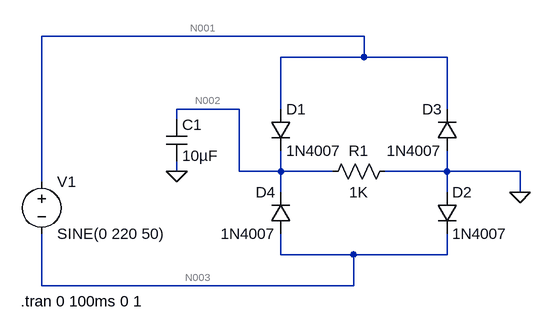
[diagram p0: schematic FullWave.asc]
FullWave.asc, the LTspice schematic file:
Version 4.1
SHEET 1 880 680
WIRE 384 -176 -112 -176
WIRE 384 -144 384 -176
WIRE 384 -144 256 -144
WIRE 512 -144 384 -144
WIRE 192 -64 96 -64
WIRE 256 -64 256 -144
WIRE 512 -64 512 -144
WIRE 96 -48 96 -64
WIRE 96 32 96 16
WIRE 192 32 192 -64
WIRE 256 32 256 0
WIRE 256 32 192 32
WIRE 336 32 256 32
WIRE 512 32 512 0
WIRE 512 32 416 32
WIRE 624 32 512 32
WIRE -112 48 -112 -176
WIRE 256 64 256 32
WIRE 512 64 512 32
WIRE 624 64 624 32
WIRE 256 160 256 128
WIRE 368 160 256 160
WIRE 512 160 512 128
WIRE 512 160 368 160
WIRE -112 208 -112 128
WIRE 368 208 368 160
WIRE 368 208 -112 208
FLAG 624 64 0
FLAG 96 32 0
SYMBOL voltage -112 32 R0
WINDOW 123 0 0 Left 0
WINDOW 39 0 0 Left 0
SYMATTR InstName V1
SYMATTR Value SINE(0 220 50)
SYMBOL diode 240 -64 R0
SYMATTR InstName D1
SYMATTR Value 1N4007
SYMBOL diode 496 64 R0
SYMATTR InstName D2
SYMATTR Value 1N4007
SYMBOL diode 528 0 R180
WINDOW 0 24 64 Left 2
WINDOW 3 24 0 Left 2
SYMATTR InstName D3
SYMATTR Value 1N4007
SYMBOL diode 272 128 R180
WINDOW 0 24 64 Left 2
WINDOW 3 24 0 Left 2
SYMATTR InstName D4
SYMATTR Value 1N4007
SYMBOL res 432 16 R90
WINDOW 0 0 56 VBottom 2
WINDOW 3 32 56 VTop 2
SYMATTR InstName R1
SYMATTR Value 1K
SYMBOL cap 80 -48 R0
SYMATTR InstName C1
SYMATTR Value 10µF
TEXT -144 232 Left 2 !.tran 0 100ms 0 1

The netlist it stands for:
* FullWave.asc
V1 N001 N003 SINE(0 220 50)
D1 N001 N002 1N4007
D2 0 N003 1N4007
D3 0 N001 1N4007
D4 N003 N002 1N4007
R1 0 N002 1K
C1 N002 0 10µF
.model D D
.lib standard.dio
.tran 0 100ms 0 1
.backanno
.end

* Results of the author's LTspice run, read from the files saved beside the schematic
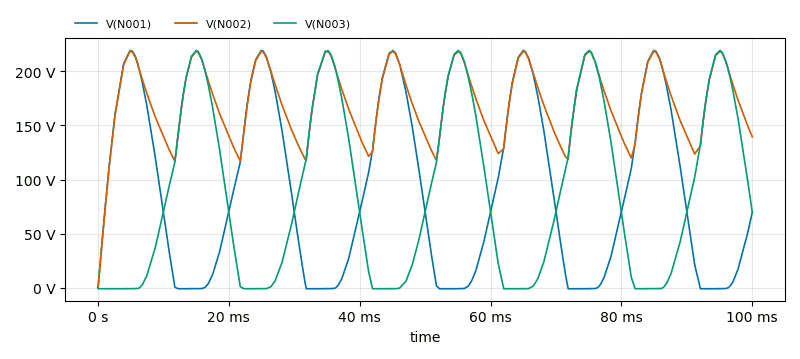
[diagram p1: Transient Analysis of FullWave.asc, plotted from the saved traces]
* Transient Analysis, 1 run:
*   V(N001): min -895.6 mV, max 219.2 V, average 85.23 V, rms 117.2 V, last 69.7 V
*   V(N002): min 0 V, max 218.4 V, average 170.5 V, rms 174.2 V, last 139.4 V
*   V(N003): min -894 mV, max 219.2 V, average 85.25 V, rms 117.4 V, last 69.7 V